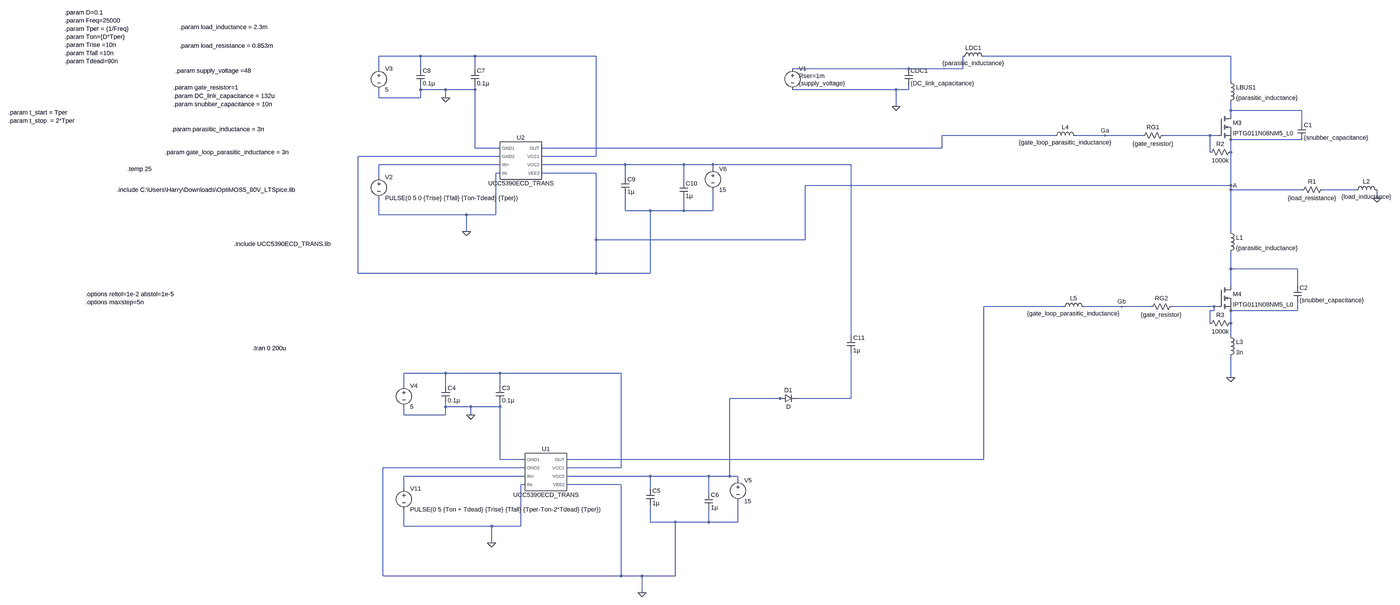
[diagram p0: schematic gate_driver_1_mos_pair.asc, whole sheet]
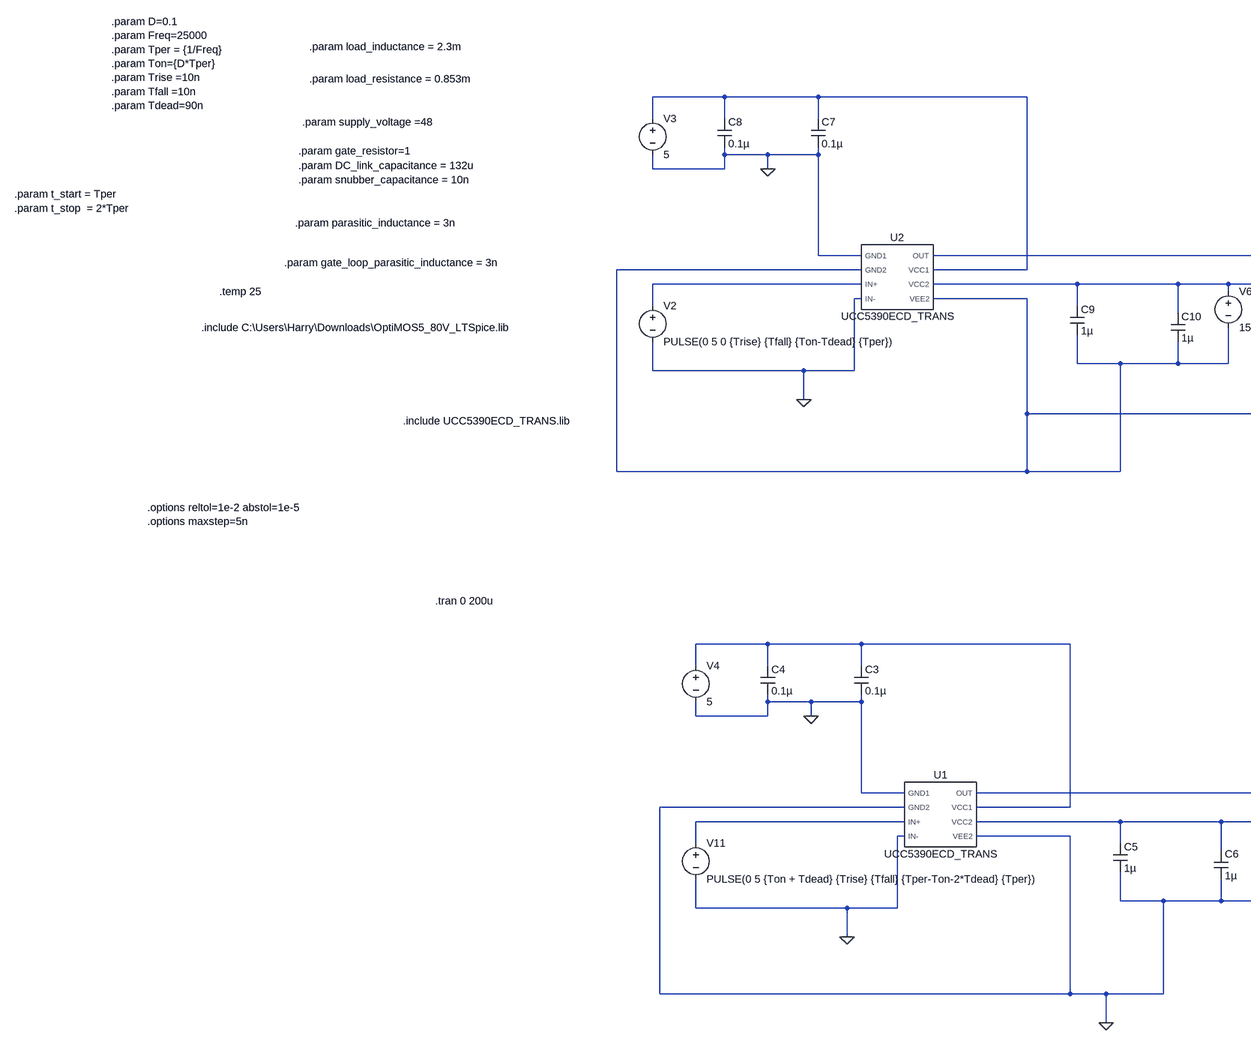
[diagram p1: schematic gate_driver_1_mos_pair.asc, part, row 1 of 1, column 1 of 2]
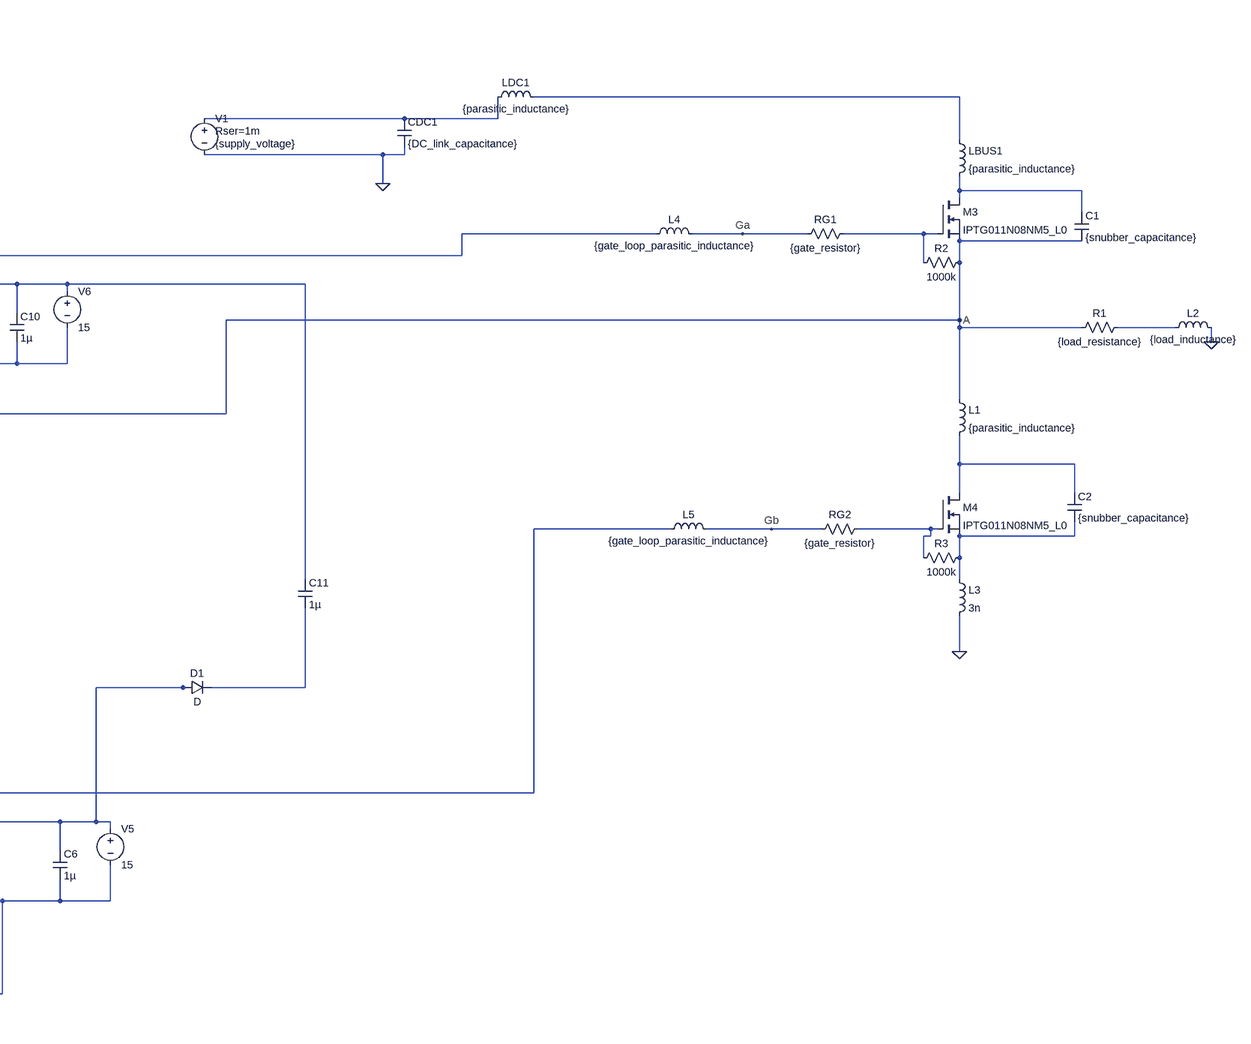
[diagram p2: schematic gate_driver_1_mos_pair.asc, part, row 1 of 1, column 2 of 2]
gate_driver_1_mos_pair.asc, the LTspice schematic file:
Version 4.1
SHEET 1 7924 1572
WIRE -2176 -560 -2336 -560
WIRE -1968 -560 -2176 -560
WIRE -1504 -560 -1968 -560
WIRE 1136 -560 80 -560
WIRE -2336 -512 -2336 -560
WIRE -2176 -512 -2176 -560
WIRE -1968 -512 -1968 -560
WIRE -208 -512 -736 -512
WIRE 0 -512 0 -560
WIRE 0 -512 -208 -512
WIRE 1136 -464 1136 -560
WIRE -2176 -432 -2176 -448
WIRE -2080 -432 -2176 -432
WIRE -1968 -432 -1968 -448
WIRE -1968 -432 -2080 -432
WIRE -256 -432 -736 -432
WIRE -208 -432 -208 -448
WIRE -208 -432 -256 -432
WIRE -2336 -400 -2336 -432
WIRE -2176 -400 -2176 -432
WIRE -2176 -400 -2336 -400
WIRE -2080 -400 -2080 -432
WIRE -256 -368 -256 -432
WIRE 1136 -352 1136 -384
WIRE 1408 -352 1136 -352
WIRE 1136 -336 1136 -352
WIRE 1408 -304 1408 -352
WIRE 352 -256 -80 -256
WIRE 544 -256 432 -256
WIRE 688 -256 544 -256
WIRE 1056 -256 768 -256
WIRE 1088 -256 1056 -256
WIRE 1408 -240 1136 -240
WIRE -1968 -208 -1968 -432
WIRE -1872 -208 -1968 -208
WIRE -80 -208 -80 -256
WIRE -80 -208 -1712 -208
WIRE 1056 -192 1056 -256
WIRE 1136 -192 1136 -240
WIRE -1872 -176 -2416 -176
WIRE -1504 -176 -1504 -560
WIRE -1504 -176 -1712 -176
WIRE -1872 -144 -2336 -144
WIRE -1392 -144 -1712 -144
WIRE -1168 -144 -1392 -144
WIRE -1056 -144 -1168 -144
WIRE -512 -144 -1056 -144
WIRE -1056 -128 -1056 -144
WIRE -1872 -112 -1888 -112
WIRE -1504 -112 -1712 -112
WIRE -2336 -96 -2336 -144
WIRE -1392 -96 -1392 -144
WIRE -1168 -80 -1168 -144
WIRE 1136 -64 1136 -192
WIRE 1136 -64 -688 -64
WIRE 1136 -48 1136 -64
WIRE 1408 -48 1136 -48
WIRE 1616 -48 1488 -48
WIRE 1696 -16 1696 -48
WIRE -1392 32 -1392 -32
WIRE -1296 32 -1392 32
WIRE -1168 32 -1168 -16
WIRE -1168 32 -1296 32
WIRE -1056 32 -1056 -48
WIRE -1056 32 -1168 32
WIRE -2336 48 -2336 -16
WIRE -2000 48 -2336 48
WIRE -1888 48 -1888 -112
WIRE -1888 48 -2000 48
WIRE -2000 112 -2000 48
WIRE 1136 112 1136 -48
WIRE -1504 144 -1504 -112
WIRE -688 144 -688 -64
WIRE -688 144 -1504 144
WIRE 1136 256 1136 192
WIRE 1392 256 1136 256
WIRE -2416 272 -2416 -176
WIRE -1504 272 -1504 144
WIRE -1504 272 -2416 272
WIRE -1296 272 -1296 32
WIRE -1296 272 -1504 272
WIRE 1136 320 1136 256
WIRE 1392 320 1392 256
WIRE 384 400 80 400
WIRE 608 400 464 400
WIRE 720 400 608 400
WIRE 1072 400 800 400
WIRE 1088 400 1072 400
WIRE 1072 416 1072 400
WIRE 1072 416 1056 416
WIRE 1136 416 1136 400
WIRE 1392 416 1392 384
WIRE 1392 416 1136 416
WIRE 1056 464 1056 416
WIRE 1136 464 1136 416
WIRE -512 512 -512 -144
WIRE 1136 512 1136 464
WIRE -2080 656 -2240 656
WIRE -1872 656 -2080 656
WIRE -1408 656 -1872 656
WIRE 1136 672 1136 592
WIRE -2240 704 -2240 656
WIRE -2080 704 -2080 656
WIRE -1872 704 -1872 656
WIRE -784 752 -992 752
WIRE -768 752 -784 752
WIRE -512 752 -512 576
WIRE -512 752 -720 752
WIRE -2080 784 -2080 768
WIRE -1984 784 -2080 784
WIRE -1872 784 -1872 768
WIRE -1872 784 -1984 784
WIRE -2240 816 -2240 784
WIRE -2080 816 -2080 784
WIRE -2080 816 -2240 816
WIRE -1984 816 -1984 784
WIRE -1872 1008 -1872 784
WIRE -1776 1008 -1872 1008
WIRE 80 1008 80 400
WIRE 80 1008 -1616 1008
WIRE -1776 1040 -2320 1040
WIRE -1408 1040 -1408 656
WIRE -1408 1040 -1616 1040
WIRE -1776 1072 -2240 1072
WIRE -1296 1072 -1616 1072
WIRE -1072 1072 -1296 1072
WIRE -992 1072 -992 752
WIRE -992 1072 -1072 1072
WIRE -960 1072 -992 1072
WIRE -960 1088 -960 1072
WIRE -1776 1104 -1792 1104
WIRE -1408 1104 -1616 1104
WIRE -2240 1120 -2240 1072
WIRE -1296 1120 -1296 1072
WIRE -1072 1136 -1072 1072
WIRE -1296 1248 -1296 1184
WIRE -1200 1248 -1296 1248
WIRE -1072 1248 -1072 1200
WIRE -1072 1248 -1200 1248
WIRE -960 1248 -960 1168
WIRE -960 1248 -1072 1248
WIRE -2240 1264 -2240 1200
WIRE -1904 1264 -2240 1264
WIRE -1792 1264 -1792 1104
WIRE -1792 1264 -1904 1264
WIRE -1904 1328 -1904 1264
WIRE -2320 1488 -2320 1040
WIRE -1408 1488 -1408 1104
WIRE -1408 1488 -2320 1488
WIRE -1328 1488 -1408 1488
WIRE -1200 1488 -1200 1248
WIRE -1200 1488 -1328 1488
WIRE -1328 1552 -1328 1488
FLAG 544 -256 Ga
FLAG 608 400 Gb
FLAG 1696 -16 0
FLAG 1136 -64 A
FLAG 1136 672 0
FLAG -1984 816 0
FLAG -1904 1328 0
FLAG -1328 1552 0
FLAG -256 -368 0
FLAG -2080 -400 0
FLAG -2000 112 0
SYMBOL voltage -736 -528 R0
WINDOW 123 0 0 Left 0
WINDOW 39 24 44 Left 2
WINDOW 3 24 72 Left 2
SYMATTR SpiceLine Rser=1m
SYMATTR Value {supply_voltage}
SYMATTR InstName V1
SYMBOL cap -224 -512 R0
SYMATTR InstName CDC1
SYMATTR Value {DC_link_capacitance}
SYMATTR SpiceLine Rser=1m
SYMBOL ind -16 -544 R270
WINDOW 0 32 56 VTop 2
WINDOW 3 5 56 VBottom 2
SYMATTR InstName LDC1
SYMATTR Value {parasitic_inductance}
SYMATTR SpiceLine Rser=1m
SYMBOL res 1504 -64 R90
WINDOW 0 0 56 VBottom 2
WINDOW 3 32 56 VTop 2
SYMATTR InstName R1
SYMATTR Value {load_resistance}
SYMBOL res 784 -272 R90
WINDOW 0 0 56 VBottom 2
WINDOW 3 32 56 VTop 2
SYMATTR InstName RG1
SYMATTR Value {gate_resistor}
SYMBOL res 816 384 R90
WINDOW 0 0 56 VBottom 2
WINDOW 3 32 56 VTop 2
SYMATTR InstName RG2
SYMATTR Value {gate_resistor}
SYMBOL ind 1120 -480 R0
SYMATTR InstName LBUS1
SYMATTR Value {parasitic_inductance}
SYMATTR SpiceLine Rser=1m
SYMBOL ind 1120 96 R0
SYMATTR InstName L1
SYMATTR Value {parasitic_inductance}
SYMATTR SpiceLine Rser=1m
SYMBOL ind 1600 -32 R270
WINDOW 0 32 56 VTop 2
WINDOW 3 5 56 VBottom 2
SYMATTR InstName L2
SYMATTR Value {load_inductance}
SYMATTR SpiceLine Rser=1m
SYMBOL ind 1120 496 R0
SYMATTR InstName L3
SYMATTR Value 3n
SYMATTR SpiceLine Rser=1m
SYMBOL ind 336 -240 R270
WINDOW 0 32 56 VTop 2
WINDOW 3 5 56 VBottom 2
SYMATTR InstName L4
SYMATTR Value {gate_loop_parasitic_inductance}
SYMATTR SpiceLine Rser=1m
SYMBOL ind 368 416 R270
WINDOW 0 32 56 VTop 2
WINDOW 3 5 56 VBottom 2
SYMATTR InstName L5
SYMATTR Value {gate_loop_parasitic_inductance}
SYMATTR SpiceLine Rser=1m
SYMBOL res 1152 -208 R90
WINDOW 0 0 56 VBottom 2
WINDOW 3 32 56 VTop 2
SYMATTR InstName R2
SYMATTR Value 1000k
SYMBOL res 1152 448 R90
WINDOW 0 0 56 VBottom 2
WINDOW 3 32 56 VTop 2
SYMATTR InstName R3
SYMATTR Value 1000k
SYMBOL cap 1392 -304 R0
SYMATTR InstName C1
SYMATTR Value {snubber_capacitance}
SYMBOL cap 1376 320 R0
SYMATTR InstName C2
SYMATTR Value {snubber_capacitance}
SYMBOL nmos 1088 -336 R0
SYMATTR InstName M3
SYMATTR Value IPTG011N08NM5_L0
SYMATTR Prefix X
SYMBOL nmos 1088 320 R0
SYMATTR InstName M4
SYMATTR Value IPTG011N08NM5_L0
SYMATTR Prefix X
SYMBOL UCC5390ECD_TRANS -1696 1056 R0
SYMATTR InstName U1
SYMBOL voltage -2240 688 R0
WINDOW 123 0 0 Left 0
WINDOW 39 0 0 Left 0
SYMATTR InstName V4
SYMATTR Value 5
SYMBOL voltage -960 1072 R0
WINDOW 123 0 0 Left 0
WINDOW 39 0 0 Left 0
SYMATTR InstName V5
SYMATTR Value 15
SYMBOL cap -1888 704 R0
SYMATTR InstName C3
SYMATTR Value 0.1µ
SYMBOL cap -2096 704 R0
SYMATTR InstName C4
SYMATTR Value 0.1µ
SYMBOL cap -1312 1120 R0
SYMATTR InstName C5
SYMATTR Value 1µ
SYMBOL cap -1088 1136 R0
SYMATTR InstName C6
SYMATTR Value 1µ
SYMBOL voltage -2240 1104 R0
WINDOW 123 0 0 Left 0
WINDOW 39 0 0 Left 0
SYMATTR InstName V11
SYMATTR Value PULSE(0 5 {Ton + Tdead} {Trise} {Tfall} {Tper-Ton-2*Tdead} {Tper})
SYMBOL voltage -2336 -112 R0
WINDOW 123 0 0 Left 0
WINDOW 39 0 0 Left 0
SYMATTR InstName V2
SYMATTR Value PULSE(0 5 0 {Trise} {Tfall} {Ton-Tdead} {Tper})
SYMBOL UCC5390ECD_TRANS -1792 -160 R0
SYMATTR InstName U2
SYMBOL voltage -2336 -528 R0
WINDOW 123 0 0 Left 0
WINDOW 39 0 0 Left 0
SYMATTR InstName V3
SYMATTR Value 5
SYMBOL voltage -1056 -144 R0
WINDOW 123 0 0 Left 0
WINDOW 39 0 0 Left 0
SYMATTR InstName V6
SYMATTR Value 15
SYMBOL cap -1984 -512 R0
SYMATTR InstName C7
SYMATTR Value 0.1µ
SYMBOL cap -2192 -512 R0
SYMATTR InstName C8
SYMATTR Value 0.1µ
SYMBOL cap -1408 -96 R0
SYMATTR InstName C9
SYMATTR Value 1µ
SYMBOL cap -1184 -80 R0
SYMATTR InstName C10
SYMATTR Value 1µ
SYMBOL diode -784 768 R270
WINDOW 0 32 32 VTop 2
WINDOW 3 0 32 VBottom 2
SYMATTR InstName D1
SYMBOL cap -528 512 R0
SYMATTR InstName C11
SYMATTR Value 1µ
TEXT -4608 160 Left 2 !.include UCC5390ECD_TRANS.lib
TEXT -4536 560 Left 2 !.tran 0 200u
TEXT -5176 352 Left 2 !.options reltol=1e-2 abstol=1e-5\n.options maxstep=5n
TEXT -5256 -728 Left 2 !.param D=0.1\n.param Freq=25000\n.param Tper = {1/Freq}\n.param Ton={D*Tper}\n.param Trise =10n\n.param Tfall =10n\n.param Tdead=90n
TEXT -5056 -48 Left 2 !.include C:\\Users\\Harry\\Downloads\\OptiMOS5_80V_LTSpice.lib
TEXT -5016 -128 Left 2 !.temp 25
TEXT -4840 -376 Left 2 !.param snubber_capacitance = 10n
TEXT -4840 -408 Left 2 !.param DC_link_capacitance = 132u
TEXT -4840 -440 Left 2 !.param gate_resistor=1
TEXT -4832 -504 Left 2 !.param supply_voltage =48
TEXT -4816 -600 Left 2 !.param load_resistance = 0.853m
TEXT -4816 -672 Left 2 !.param load_inductance = 2.3m
TEXT -4848 -280 Left 2 !.param parasitic_inductance = 3n
TEXT -4872 -192 Left 2 !.param gate_loop_parasitic_inductance = 3n
TEXT -5472 -344 Left 2 !.param t_start = Tper\n.param t_stop  = 2*Tper

The netlist it stands for:
* gate_driver_1_mos_pair.asc
V1 N003 0 {supply_voltage} Rser=1m
CDC1 N003 0 {DC_link_capacitance} Rser=1m
LDC1 N003 N002 {parasitic_inductance} Rser=1m
R1 N009 A {load_resistance}
RG1 N006 Ga {gate_resistor}
RG2 N012 Gb {gate_resistor}
LBUS1 N002 N004 {parasitic_inductance} Rser=1m
L1 A N010 {parasitic_inductance} Rser=1m
L2 N009 0 {load_inductance} Rser=1m
L3 N013 0 3n Rser=1m
L4 N005 Ga {gate_loop_parasitic_inductance} Rser=1m
L5 N011 Gb {gate_loop_parasitic_inductance} Rser=1m
R2 A N006 1000k
R3 N013 N012 1000k
C1 N004 A {snubber_capacitance}
C2 N010 N013 {snubber_capacitance}
X§M3 N004 N006 A IPTG011N08NM5_L0  ; pins D G S
X§M4 N010 N012 N013 IPTG011N08NM5_L0  ; pins D G S
X§U1 0 0 N017 0 N011 N014 N015 0 UCC5390ECD_TRANS  ; pins GND1 GND2 IN+ IN- OUT VCC1 VCC2 VEE2
V4 N014 0 5
V5 N015 0 15
C3 N014 0 0.1µ
C4 N014 0 0.1µ
C5 N015 0 1µ
C6 N015 0 1µ
V11 N017 0 PULSE(0 5 {Ton + Tdead} {Trise} {Tfall} {Tper-Ton-2*Tdead} {Tper})
V2 N007 0 PULSE(0 5 0 {Trise} {Tfall} {Ton-Tdead} {Tper})
X§U2 0 A N007 0 N005 N001 N008 A UCC5390ECD_TRANS  ; pins GND1 GND2 IN+ IN- OUT VCC1 VCC2 VEE2
V3 N001 0 5
V6 N008 A 15
C7 N001 0 0.1µ
C8 N001 0 0.1µ
C9 N008 A 1µ
C10 N008 A 1µ
D1 N015 N016 D
C11 N008 N016 1µ
.model D D
.lib standard.dio
.include UCC5390ECD_TRANS.lib
.tran 0 200u
.options reltol=1e-2 abstol=1e-5
.options maxstep=5n
.param D=0.1
.param Freq=25000
.param Tper = {1/Freq}
.param Ton={D*Tper}
.param Trise =10n
.param Tfall =10n
.param Tdead=90n
.include C:\Users\Harry\Downloads\OptiMOS5_80V_LTSpice.lib
.temp 25
.param snubber_capacitance = 10n
.param DC_link_capacitance = 132u
.param gate_resistor=1
.param supply_voltage =48
.param load_resistance = 0.853m
.param load_inductance = 2.3m
.param parasitic_inductance = 3n
.param gate_loop_parasitic_inductance = 3n
.param t_start = Tper
.param t_stop  = 2*Tper
.lib UCC5390ECD_TRANS.LIB
.backanno
.end